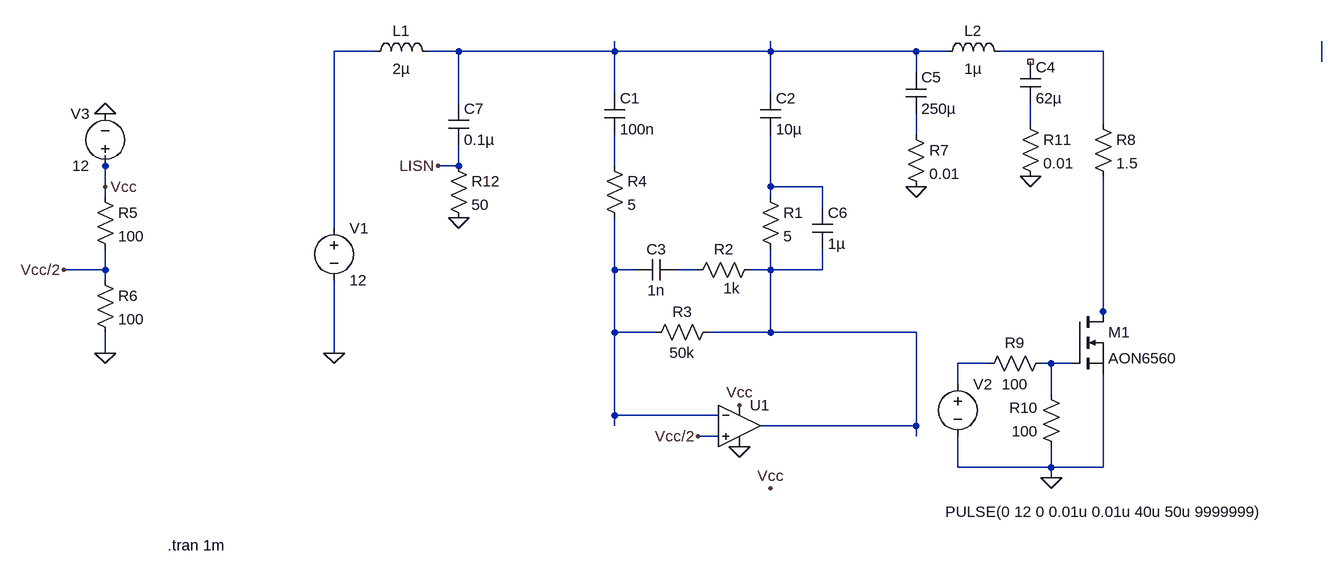
[diagram p0: schematic Draft5.asc]
Draft5.asc, the LTspice schematic file:
Version 4
SHEET 1 3444 680
WIRE -336 -128 -400 -128
WIRE -208 -128 -256 -128
WIRE 32 -128 32 -144
WIRE 32 -128 -208 -128
WIRE 272 -128 272 -144
WIRE 272 -128 32 -128
WIRE 496 -128 272 -128
WIRE 544 -128 496 -128
WIRE 784 -128 624 -128
WIRE 1120 -112 1120 -144
WIRE 496 -96 496 -128
WIRE 32 -64 32 -128
WIRE 272 -64 272 -128
WIRE -208 -48 -208 -128
WIRE 672 -16 672 -48
WIRE 784 -16 784 -128
WIRE 496 0 496 -32
WIRE -752 48 -752 32
WIRE -208 48 -208 16
WIRE -208 48 -240 48
WIRE 32 48 32 0
WIRE -752 80 -752 48
WIRE 272 80 272 0
WIRE 352 80 272 80
WIRE -752 96 -752 80
WIRE 272 96 272 80
WIRE 352 112 352 80
WIRE -400 144 -400 -128
WIRE -752 208 -752 176
WIRE -752 208 -816 208
WIRE 32 208 32 128
WIRE 64 208 32 208
WIRE 160 208 128 208
WIRE 272 208 272 176
WIRE 272 208 240 208
WIRE 352 208 352 176
WIRE 352 208 272 208
WIRE -752 224 -752 208
WIRE 784 272 784 64
WIRE 784 288 784 272
WIRE 32 304 32 208
WIRE 96 304 32 304
WIRE 272 304 272 208
WIRE 272 304 176 304
WIRE 496 304 272 304
WIRE -752 336 -752 304
WIRE -400 336 -400 224
WIRE 608 352 560 352
WIRE 704 352 688 352
WIRE 736 352 704 352
WIRE 560 384 560 352
WIRE 704 400 704 352
WIRE 32 432 32 304
WIRE 192 432 32 432
WIRE 32 448 32 432
WIRE 496 448 496 304
WIRE 496 448 256 448
WIRE 192 464 160 464
WIRE 496 464 496 448
WIRE 560 512 560 464
WIRE 704 512 704 480
WIRE 704 512 560 512
WIRE 784 512 784 368
WIRE 784 512 704 512
WIRE 704 528 704 512
FLAG -400 336 0
FLAG -816 208 Vcc/2
FLAG -752 336 0
FLAG 496 80 0
FLAG -752 80 Vcc
FLAG 224 416 Vcc
FLAG 272 544 Vcc
FLAG 160 464 Vcc/2
FLAG 224 480 0
FLAG 704 528 0
FLAG -752 -32 0
FLAG -208 128 0
FLAG -240 48 LISN
FLAG 672 64 0
DATAFLAG 128 -128 ""
DATAFLAG 400 -128 ""
DATAFLAG 752 -128 ""
DATAFLAG 752 -128 ""
SYMBOL cap 16 -64 R0
SYMATTR InstName C1
SYMATTR Value 100n
SYMBOL cap 256 -64 R0
SYMATTR InstName C2
SYMATTR Value 10µ
SYMBOL res 256 80 R0
SYMATTR InstName R1
SYMATTR Value 5
SYMBOL cap 128 192 R90
WINDOW 0 0 32 VBottom 2
WINDOW 3 32 32 VTop 2
SYMATTR InstName C3
SYMATTR Value 1n
SYMBOL res 256 192 R90
WINDOW 0 0 56 VBottom 2
WINDOW 3 29 44 VTop 2
SYMATTR InstName R2
SYMATTR Value 1k
SYMBOL res 192 288 R90
WINDOW 0 0 56 VBottom 2
WINDOW 3 32 56 VTop 2
SYMATTR InstName R3
SYMATTR Value 50k
SYMBOL res -768 80 R0
SYMATTR InstName R5
SYMATTR Value 100
SYMBOL res -768 208 R0
SYMATTR InstName R6
SYMATTR Value 100
SYMBOL res 16 32 R0
SYMATTR InstName R4
SYMATTR Value 5
SYMBOL res 480 -16 R0
SYMATTR InstName R7
SYMATTR Value 0.01
SYMBOL voltage -400 128 R0
WINDOW 123 0 0 Left 0
WINDOW 39 24 124 Left 2
SYMATTR InstName V1
SYMATTR Value 12
SYMBOL ind -352 -112 R270
WINDOW 0 32 56 VTop 2
WINDOW 3 5 56 VBottom 2
SYMATTR InstName L1
SYMATTR Value 2µ
SYMBOL nmos 736 272 R0
SYMATTR InstName M1
SYMATTR Value AON6560
SYMBOL res 704 336 R90
WINDOW 0 0 56 VBottom 2
WINDOW 3 32 56 VTop 2
SYMATTR InstName R9
SYMATTR Value 100
SYMBOL res 720 496 R180
WINDOW 0 36 76 Left 2
WINDOW 3 36 40 Left 2
SYMATTR InstName R10
SYMATTR Value 100
SYMBOL voltage 560 368 R0
WINDOW 3 -19 212 Left 2
WINDOW 123 0 0 Left 0
WINDOW 39 0 0 Left 0
SYMATTR Value PULSE(0 12 0 0.01u 0.01u 40u 50u 9999999)
SYMATTR InstName V2
SYMBOL voltage -752 64 R180
WINDOW 0 24 96 Left 2
WINDOW 3 24 16 Left 2
WINDOW 123 0 0 Left 0
WINDOW 39 0 0 Left 0
SYMATTR InstName V3
SYMATTR Value 12
SYMBOL cap 480 -96 R0
SYMATTR InstName C5
SYMATTR Value 250µ
SYMBOL ind 528 -112 R270
WINDOW 0 32 56 VTop 2
WINDOW 3 5 56 VBottom 2
SYMATTR InstName L2
SYMATTR Value 1µ
SYMBOL cap -224 -48 R0
SYMATTR InstName C7
SYMATTR Value 0.1µ
SYMBOL res -224 32 R0
SYMATTR InstName R12
SYMATTR Value 50
SYMBOL OpAmps\\UniversalOpamp2 224 448 R0
SYMATTR InstName U1
SYMATTR Value2 Avol=1Meg GBW=100Meg Slew=100Meg
SYMATTR SpiceLine ilimit=0.25 rail=0 Vos=0 phimargin=45
SYMBOL res 768 -32 R0
SYMATTR InstName R8
SYMATTR Value 1.5
SYMBOL res 656 -32 R0
SYMATTR InstName R11
SYMATTR Value 0.01
SYMBOL cap 656 -112 R0
SYMATTR InstName C4
SYMATTR Value 62µ
SYMBOL cap 336 112 R0
SYMATTR InstName C6
SYMATTR Value 1µ
TEXT -656 632 Left 2 !.tran 1m

The netlist it stands for:
* Draft5.asc
C1 N002 N007 100n
C2 N002 N008 10µ
R1 N008 N011 5
C3 N010 N009 1n
R2 N011 N010 1k
R3 N011 N009 50k
R5 Vcc Vcc/2 100
R6 Vcc/2 0 100
R4 N007 N009 5
R7 N006 0 0.01
V1 N001 0 12
L1 N001 N002 2µ
M1 N012 N014 0 0 AON6560
R9 N014 N013 100
R10 0 N014 100
V2 N013 0 PULSE(0 12 0 0.01u 0.01u 40u 50u 9999999)
V3 Vcc 0 12
C5 N002 N006 250µ
L2 N002 N003 1µ
C7 N002 LISN 0.1µ
R12 LISN 0 50
XU1 Vcc/2 N009 Vcc 0 N011 level.2 Avol=1Meg GBW=100Meg Slew=100Meg ilimit=0.25 rail=0 Vos=0 phimargin=45 en=0 enk=0 in=0 ink=0 Rin=500Meg  ; pins IN+ IN- V+ V- OUT
R8 N003 N012 1.5
R11 N005 0 0.01
C4 NC_01 N005 62µ
C6 N008 N011 1µ
.model NMOS NMOS
.model PMOS PMOS
.lib standard.mos
.tran 1m
.lib UniversalOpamps2.sub
.backanno
.end